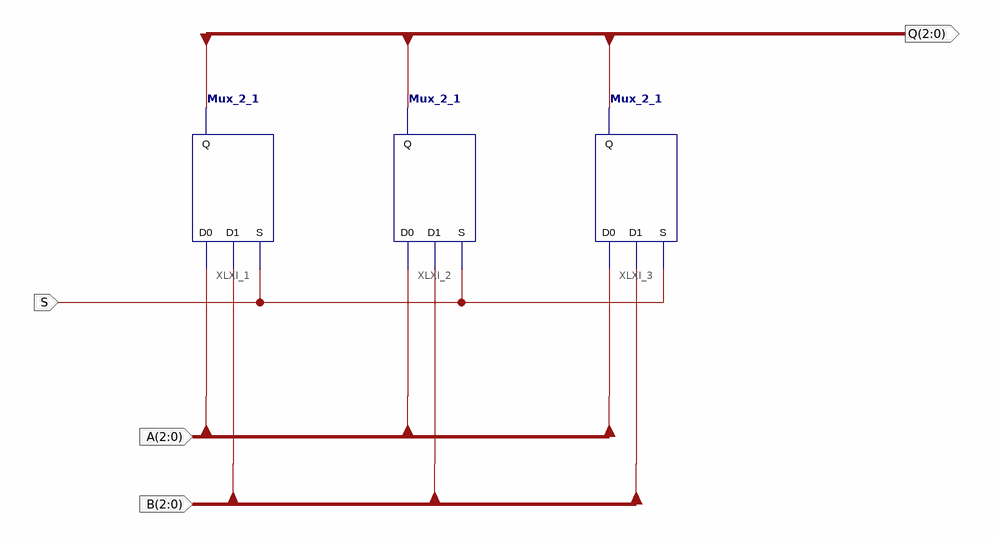
[diagram p0: schematic sheet 1]
// Xilinx ISE schematic Mux_3_bit_2_way.sch (spartan3e) as structural Verilog: 3 symbols, 4 ports
module Mux_3_bit_2_way (
  input  S,
  input  [2:0] A,
  input  [2:0] B,
  output [2:0] Q
);

  Mux_2_1 XLXI_1 (.D0(A[0]), .D1(B[0]), .Q(Q[0]), .S(S));
  Mux_2_1 XLXI_2 (.D0(A[1]), .D1(B[1]), .Q(Q[1]), .S(S));
  Mux_2_1 XLXI_3 (.D0(A[2]), .D1(B[2]), .Q(Q[2]), .S(S));
endmodule
